# EAGLE design SensorDHT22 (EAGLE 7.5.0)
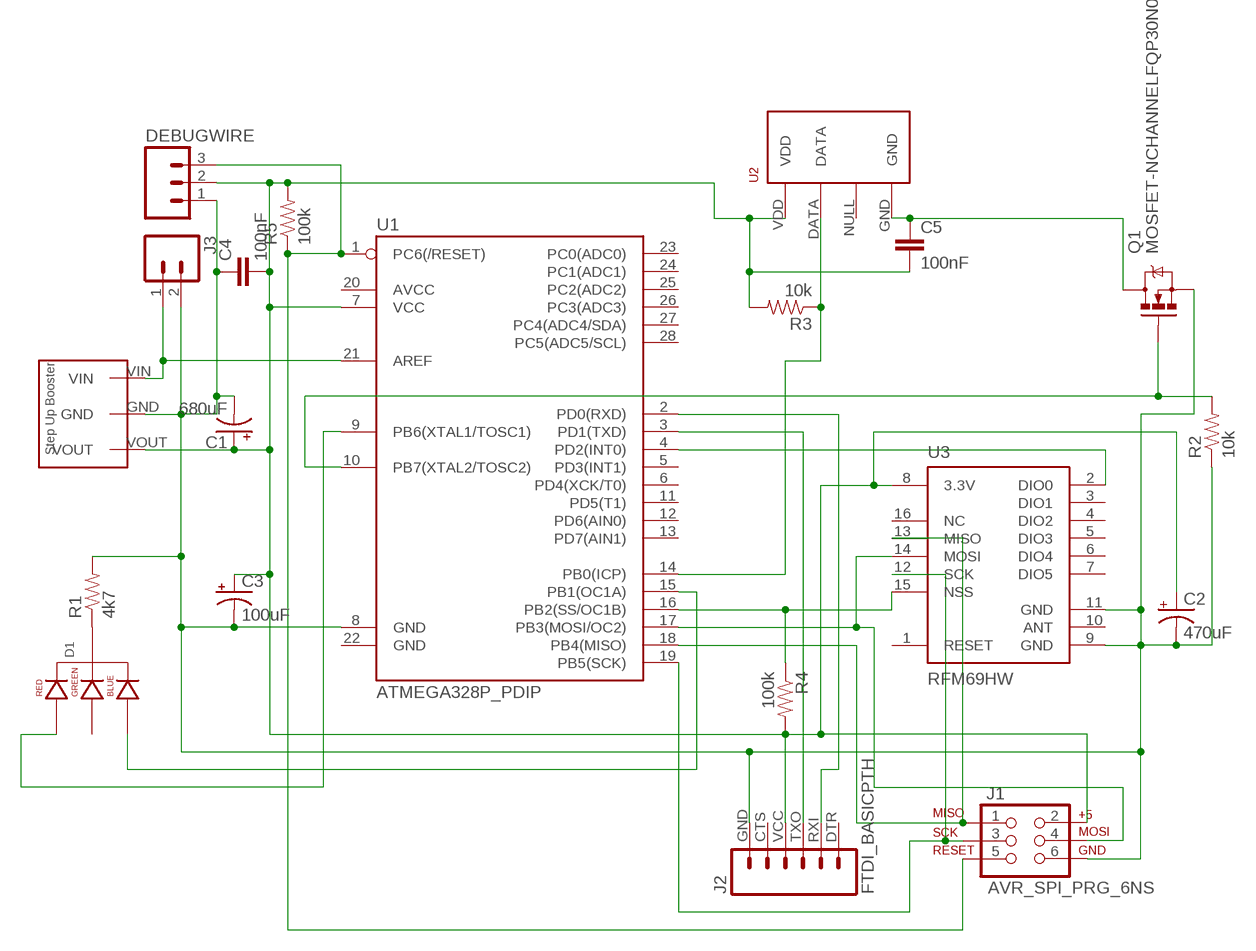
[diagram p0: schematic, sheet 1]

## Parts
C1  680uF  CAP_POLPTH1  [CPOL-RADIAL-100UF-25V]
C2  470uF  CAP_POLPTH1  [CPOL-RADIAL-100UF-25V]
C3  100uF  CAP_POLPTH2  [CPOL-RADIAL-10UF-25V]
C4  100nF  CAPPTH  [CAP-PTH-SMALL]
C5  100nF  CAPPTH  [CAP-PTH-SMALL]
D1  LED-RGB-CC-THRUCLEAR  [LED-RGB-THRU]
DEBUGWIRE  M03PTH  [1X03]
J1  AVR_SPI_PRG_6NS  [2X3-NS]
J2  FTDI_BASICPTH  [FTDI_BASIC]
J3  M02POLAR  [MOLEX-1X2]
Q1  MOSFET-NCHANNELFQP30N06L  [TO220V]
R1  4k7  RESISTORPTH-1/4W  [AXIAL-0.4]
R2  10k  10KOHM-1/4W-1%(PTH)HORIZ  [AXIAL-0.3]
R3  10k  10KOHM-1/4W-1%(PTH)HORIZ  [AXIAL-0.3]
R4  100k  RESISTORPTH-1/4W  [AXIAL-0.4]
R5  100k  100KOHM-1/4W-5%(PTH)  [AXIAL-0.3]
STEPUP  POLOLU-2563  [POLOLU-2563]
U1  ATMEGA328P_PDIP  [DIL28-3]
U2  RHT03_DHT-22_AM2302  [RHT03_DHT-22]
U3  RFM69HW  [RFM69W-XXXS2]

## Nets
N$1: C1.2(-) C2.2(-) C3.2(-) C4.1 DEBUGWIRE.1 J1.6 J2.GND J3.2 Q1.3(S) R1.P$2 R2.P$1 STEPUP.GND U1.8(GND) U3.9(GND) U3.11(GND)
N$2: J3.1 STEPUP.VIN U1.21(AREF)
N$3: C5.1 Q1.2(D) U2.GND
N$4: J2.TXO U1.3(PD1(TXD))
N$5: R4.P$1 U1.16(PB2(SS/OC1B)) U3.15(NSS)
N$6: Q1.1(G) R2.P$2 U1.10(PB7(XTAL2/TOSC2))
N$7: J2.RXI U1.2(PD0(RXD))
N$8: U1.4(PD2(INT0)) U3.2(DIO0)
N$9: R3.P$1 U1.14(PB0(ICP)) U2.DATA
N$10: D1.4(BLUE_CATHODE) U1.15(PB1(OC1A))
N$11: D1.1(RED_CATHODE) U1.9(PB6(XTAL1/TOSC1))
N$12: D1.2(CATHODE) R1.P$1
N$13: J1.4 U1.17(PB3(MOSI/OC2)) U3.14(MOSI)
N$14: J1.1 U1.18(PB4(MISO)) U3.13(MISO)
N$15: DEBUGWIRE.3 J1.5 R5.P$1 U1.1(PC6(/RESET))
N$16: C1.1(+) C2.1(+) C3.1(+) C4.2 C5.2 DEBUGWIRE.2 J1.2 J2.VCC R3.P$2 R4.P$2 R5.P$2 STEPUP.VOUT U1.7(VCC) U2.VDD U3.8(3.3V)
N$17: J1.3 U1.19(PB5(SCK)) U3.12(SCK)
Unconnected: D1.3(GREEN_CATHODE) J2.CTS J2.DTR U1.5(PD3(INT1)) U1.6(PD4(XCK/T0)) U1.11(PD5(T1)) U1.12(PD6(AIN0)) U1.13(PD7(AIN1)) U1.20(AVCC) U1.22(GND) U1.23(PC0(ADC0)) U1.24(PC1(ADC1)) U1.25(PC2(ADC2)) U1.26(PC3(ADC3)) U1.27(PC4(ADC4/SDA)) U1.28(PC5(ADC5/SCL)) U2.NULL U3.1(RESET) U3.3(DIO1) U3.4(DIO2) U3.5(DIO3) U3.6(DIO4) U3.7(DIO5) U3.10(ANT) U3.16(NC)

## Library data of the parts
C1-C3 = SparkFun-Capacitors:CAP_POL: Capacitor Polarized These are standard SMD and PTH capacitors. Normally 10uF, 47uF, and 100uF in electrolytic and tantalum varieties. Always verify the external diameter of the through hole cap, it varies with capacity, voltage, and manufacturer. The EIA devices should be standard.
C4 C5 = SparkFun-Capacitors:CAP: Capacitor Standard 0603 ceramic capacitor, and 0.1" leaded capacitor.
D1 = SparkFun-LED:LED-RGB-CC-THRU: RGB Through-hole common cathode LED SparkFun Storefront: COM-00105 (Clear) COM-09264 (Diffuse); PROD_ID: DIO-08418
DEBUGWIRE = SparkFun-Connectors:M03: Header 3 Standard 3-pin 0.1" header. Use with straight break away headers (SKU : PRT-00116), right angle break away headers (PRT-00553), swiss pins (PRT-00743), machine pins (PRT-00117), and female headers (PRT-00115). Molex polarized connector foot print use with SKU : PRT-08232 with associated crimp pins and housings.
J1 = SparkFun-Connectors:AVR_SPI_PRG_6: AVR ISP 6 Pin This is the reduced ISP connector for AVR programming. Common on Arduino. This footprint will take up less PCB space and can be used with a 10-pin to 6-pin adapter such as SKU: BOB-08508 **Special note about "TEST_POINT" package. The stop mask is on the top side, so if you want your programming test points to be on the bottom of your board, make sure to place this package on the bottom side of the board. This also ensure that the orientation to program from the bottom side will be correct.
J2 = SparkFun-Connectors:FTDI_BASIC: FTDI Basic header with labels
J3 = SparkFun-Connectors:M02: Standard 2-pin 0.1" header. Use with - straight break away headers ( PRT-00116) - right angle break away headers (PRT-00553) - swiss pins (PRT-00743) - machine pins (PRT-00117) - female headers (PRT-00115) Molex polarized connector foot print use with: PRT-08233 with associated crimp pins and housings. 2.54_SCREWTERM for use with PRT-10571. 3.5mm Screw Terminal footprints for PRT-08084 5mm Screw Terminal footprints for use with PRT-08432
Q1 = SparkFun-DiscreteSemi:MOSFET-NCHANNEL: Common NMOSFET Parts MFG P/N Store ID Prod ID FDD8780 TRANS-09984 SI7820DN TRANS-11055 FDS6630A IC-08089 2N7002PW TRANS-11151 FQP30N06L COM-10213 TRANS-10060 BSS123LT1G TRANS-08345 BSS138 TRANS-00830 BS170 2N7000; PROD_ID: TRANS-10060
R1 R4 = SparkFun-Passives:RESISTOR: Resistor Basic schematic elements and footprints for 0603, 1206, and PTH resistors.
R2 R3 = SparkFun-Resistors:10KOHM-1/4W-1%(PTH): RES-12183; PROD_ID: RES-12183
R5 = SparkFun-Resistors:100KOHM-1/4W-5%(PTH): RES-10686; PROD_ID: RES-10686
STEPUP = PololuStepUp:POLOLU-2563
U1 = SparkFun-DigitalIC:ATMEGA328P_PDIP: uC used in the Arduino 32kb flash, 1k EEPROM, 2k SRAM This is the through-hole version of this chip.
U2 = RHT03_DHT-22_AM2302:RHT03_DHT-22_AM2302: RHT03 / DHT-22 / AM2302 Packages and symbol for the RHT03 / DHT-22 relative humidity and temperature sensor. Note: The AM2302 is a wired version of the DHT-22 which typically requires less clearance and is thus provided as a separate package.; PROD_ID: SEN-10167
U3 = SparkFun-RF:RFM69H

## Board
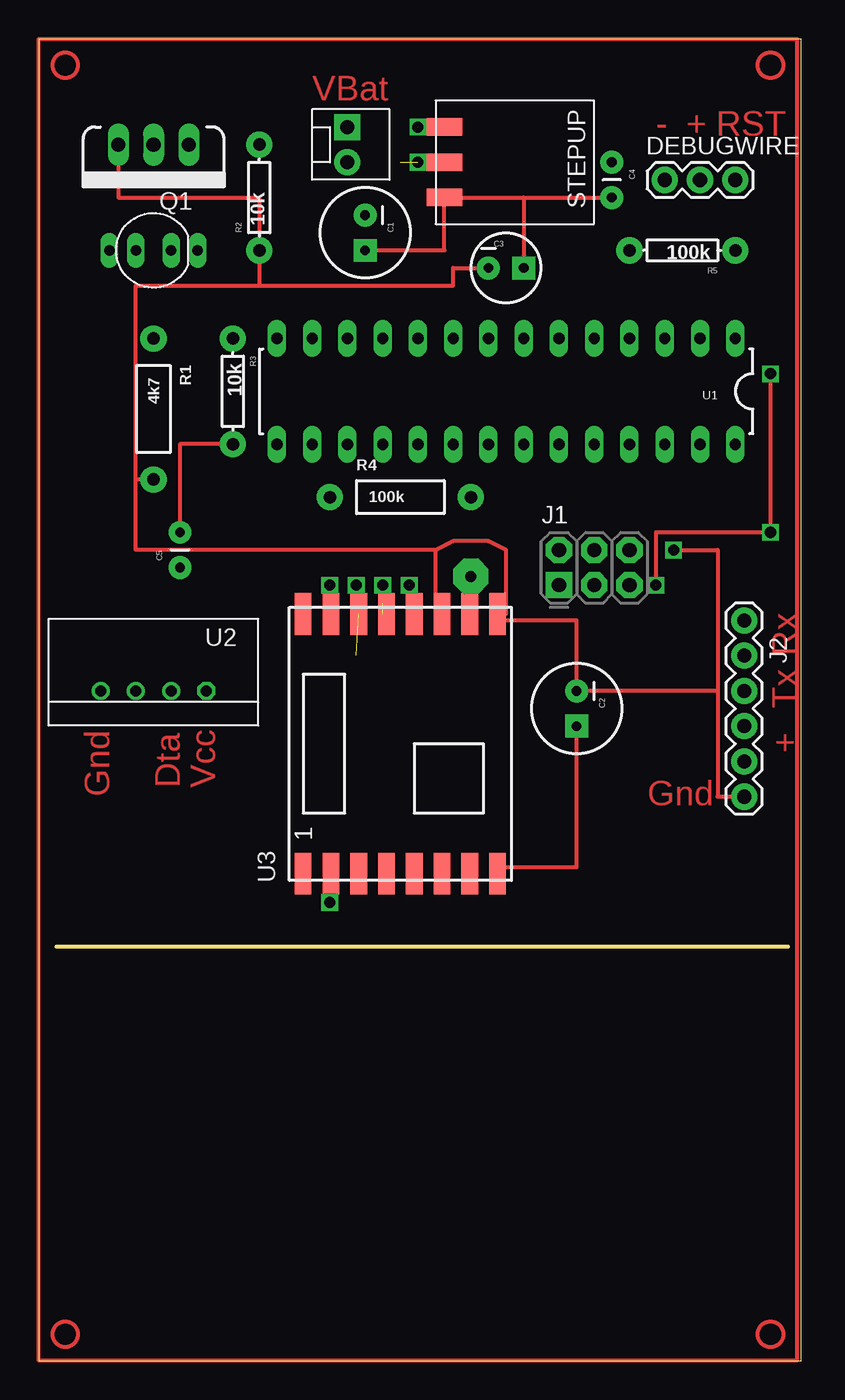
[diagram p1: board, top side]
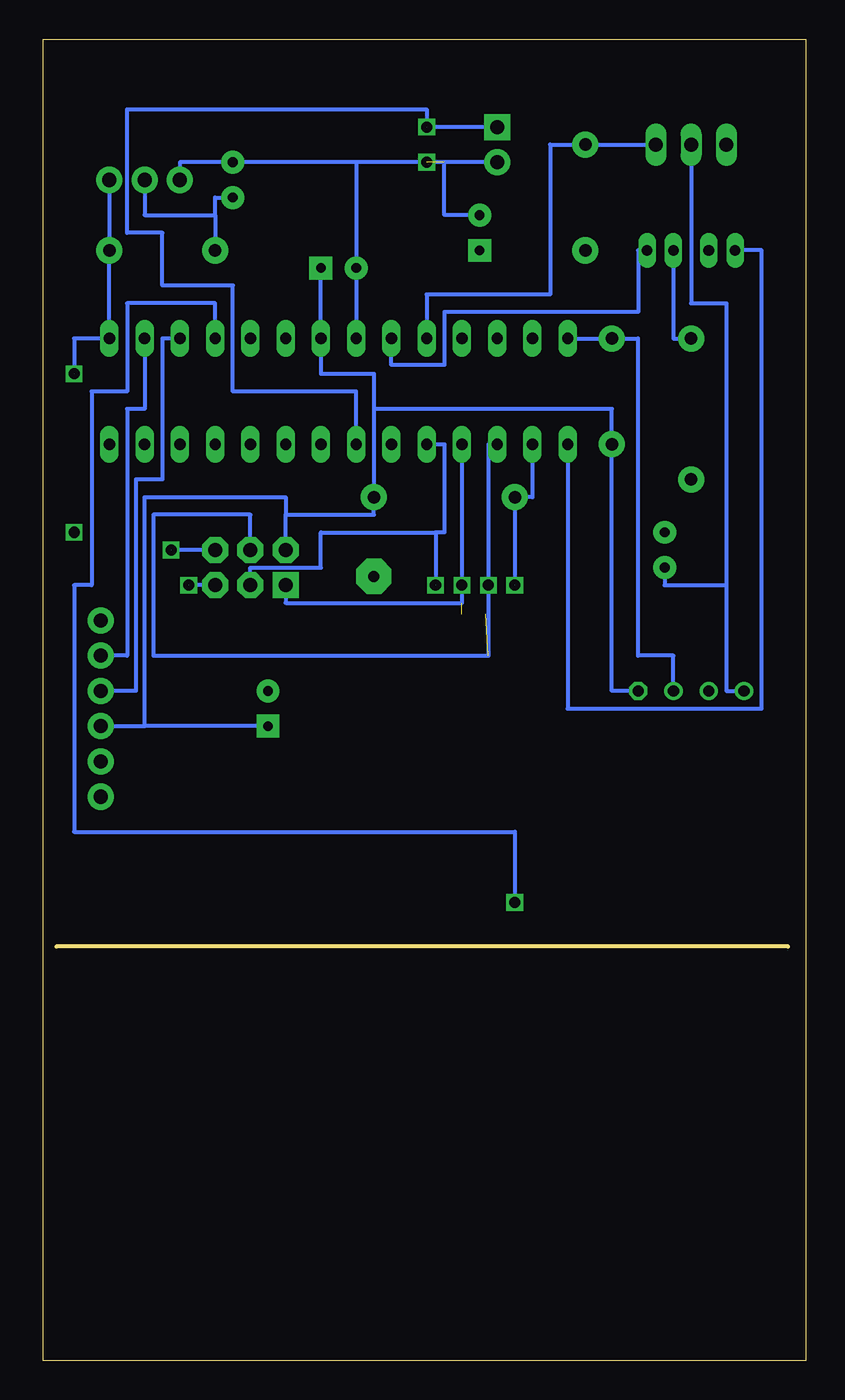
[diagram p2: board, bottom side, seen from below]

Size 54.92 x 95.24 mm. Coordinates in mm from the lower left corner, seen from the top.
Outline: 1.27,29.84 53.97,29.84
Outline: 0,0 54.92,0 54.92,95.24 0,95.24 0,0
Copper layers (1*16): Top 0.035mm / dielectric 1.5mm / Bottom 0.035mm
Design rules "default": minimum track width 10mil, minimum drill 24mil, track to track 8mil, track to pad 8mil, pad to pad 8mil, via to via 8mil, smd to smd 8mil, copper to edge 40mil, drill to drill 8mil, minimum pad ring 10mil, minimum via ring 8mil, stop-mask expansion 4mil, vias tented up to drill 0mil, thermal gap 10mil

### Footprints (pad centres in the part's own frame; a part is rotated, then mirrored left to right if it is on the bottom)
CPOL-RADIAL-100UF-25V = drill 0.7 pad 1.651 square: 1 1.27,0 | drill 0.7 pad 1.651: 2 -1.27,0
CPOL-RADIAL-10UF-25V = drill 0.7 pad 1.651 square: 1 1.27,0 | drill 0.7 pad 1.651: 2 -1.27,0
CAP-PTH-SMALL = drill 0.7 pad 1.651: 1 0,0; 2 2.54,0
LED-RGB-THRU = drill 0.762 pad 0.889 long: 1 3.175,0; 2 1.27,0; 3 -1.27,0; 4 -3.175,0
1X03 = drill 1.016 pad 1.88: 1 0,0; 2 2.54,0; 3 5.08,0
2X3-NS = drill 1.016 pad 1.88 square: 1 -2.54,-1.27 | drill 1.016 pad 1.88 octagon: 2 -2.54,1.27; 3 0,-1.27; 4 0,1.27; 5 2.54,-1.27; 6 2.54,1.27
FTDI_BASIC = drill 1.016 pad 1.88: CTS 10.16,0; DTR 0,0; GND 12.7,0; RXI 2.54,0; TXO 5.08,0; VCC 7.62,0
MOLEX-1X2 = drill 1.016 pad 1.88 square: 1 0,0 | drill 1.016 pad 1.88: 2 2.54,0
TO220V = drill 1.016 long: 1 -2.54,0; 2 0,0; 3 2.54,0
AXIAL-0.4 = drill 0.9 pad 1.88: P$1 -5.08,0; P$2 5.08,0
AXIAL-0.3 = drill 0.9 pad 1.88: P$1 -3.81,0; P$2 3.81,0
POLOLU-2563 = smd 1.27 x 2.54: GND 0,-0.635; VIN -2.54,-0.635; VOUT 2.54,-0.635
DIL28-3 = drill 0.813 long: 1 -16.51,-3.81; 2 -13.97,-3.81; 3 -11.43,-3.81; 4 -8.89,-3.81; 5 -6.35,-3.81; 6 -3.81,-3.81; 7 -1.27,-3.81; 8 1.27,-3.81; 9 3.81,-3.81; 10 6.35,-3.81; 11 8.89,-3.81; 12 11.43,-3.81; 13 13.97,-3.81; 14 16.51,-3.81; 15 16.51,3.81; 16 13.97,3.81; 17 11.43,3.81; 18 8.89,3.81; 19 6.35,3.81; 20 3.81,3.81; 21 1.27,3.81; 22 -1.27,3.81; 23 -3.81,3.81; 24 -6.35,3.81; 25 -8.89,3.81; 26 -11.43,3.81; 27 -13.97,3.81; 28 -16.51,3.81
RHT03_DHT-22 = drill 0.8: DATA -1.27,0; GND 3.81,0; NULL 1.27,0 | drill 0.8 octagon: VDD -3.81,0
RFM69W-XXXS2 = smd 3 x 1.2: 1 -9.35,7; 2 -9.35,5; 3 -9.35,3; 4 -9.35,1; 5 -9.35,-1; 6 -9.35,-3; 7 -9.35,-5; 8 -9.35,-7; 9 9.35,-7; 10 9.35,-5; 11 9.35,-3; 12 9.35,-1; 13 9.35,1; 14 9.35,3; 15 9.35,5; 16 9.35,7

### Placement (x,y rotation side)
C1  23.5,81.28 270 top
C2  38.73,46.99 270 top
C3  33.66,78.74 0 top
C4  41.28,86.36 270 top
C5  10.16,57.15 90 top
D1  8.26,80.01 0 top
DEBUGWIRE  45.08,85.09 0 top
J1  40,57.15 0 top
J2  50.8,53.34 270 top
J3  22.23,88.9 270 top
Q1  8.26,87.63 180 top
R1  8.26,68.58 270 top
R2  15.88,83.82 90 top
R3  13.97,69.85 270 top
R4  26.04,62.23 0 top
R5  46.36,80.01 180 top
STEPUP  29.85,86.36 270 top
U1  33.66,69.85 180 top
U2  8.26,48.26 180 top
U3  26.04,44.45 90 top

### Tracks (layer width: path | path; a pad name or v marks a point on that pad's centre or on a via)
N$1  (2 unrouted)
  Top 0.305: U3.9 33.02,53.82 33.66,53.82 33.66,58.42 32.39,59.05 29.85,59.05 28.57,58.42 | 28.57,58.42 6.98,58.42 6.98,63.5 | 6.98,63.5 6.98,77.47 15.88,77.47 | 15.88,77.47 29.85,77.47 29.85,78.74 C3.2 | 33.5,53.34 38.73,53.34 C2.2 48.89,48.26 | 45.72,58.42 48.89,58.42 48.89,48.26 | STEPUP.GND 27.31,86.36 | U3.11 28.57,53.8 28.57,58.42 | 48.89,48.26 48.89,40.64 J2.GND | R1.P$2 6.98,63.5 | Q1.3 5.71,83.82 15.88,83.82 R2.P$1 15.88,77.47
  Top 0.406: U3.9 33.5,53.34
  Bottom 0.305: J3.2 26.04,86.36 | 26.04,86.36 32.39,86.36 | U1.8 C3.2 32.39,86.36 | 32.39,86.36 C4.1 45.08,86.36 DEBUGWIRE.1 | J1.6 45.72,58.42 | C1.2 26.04,82.55 26.04,86.36
N$2  (1 unrouted)
  Top 0.305: STEPUP.VIN 27.31,88.9
  Bottom 0.305: J3.1 27.31,88.9 27.31,90.17 48.89,90.17 48.89,81.28 46.36,81.28 46.36,77.47 41.28,77.47 41.28,69.85 32.39,69.85 U1.21
N$3
  Bottom 0.305: 5.71,55.88 5.71,48.26 U2.GND | C5.1 10.16,55.88 5.71,55.88 | Q1.2 8.26,76.2 5.71,76.2 5.71,55.88
N$4
  Bottom 0.305: U1.3 46.36,73.66 46.36,63.5 48.26,63.5 48.26,48.26 J2.TXO
N$5  (1 unrouted)
  Top 0.305: U3.15 20.96,53.8 20.96,55.88
  Bottom 0.305: 20.96,55.88 R4.P$1 19.68,62.23 U1.16
N$6
  Bottom 0.305: U1.10 27.31,76.83 18.41,76.83 18.41,87.63 R2.P$2 Q1.1
N$7
  Bottom 0.305: U1.2 47.62,68.58 48.89,68.58 48.89,50.8 J2.RXI
N$8  (via drill 0.8)
  Top 0.305: v20.96,33.02 21.04,33.02 U3.2
  Bottom 0.305: U1.4 42.55,76.2 48.89,76.2 48.89,69.85 51.44,69.85 51.44,55.88 52.7,55.88 52.7,38.1 20.96,38.1 v20.96,33.02
N$9
  Bottom 0.305: U2.DATA 9.53,50.8 12.07,50.8 12.07,73.66 R3.P$1 U1.14
N$10
  Bottom 0.305: U1.15 17.14,46.99 3.18,46.99 3.18,80.01 D1.4
N$11
  Bottom 0.305: D1.1 12.07,80.01 12.07,75.56 26.04,75.56 26.04,71.75 29.85,71.75 U1.9
N$12
  Bottom 0.305: D1.2 9.53,73.66 R1.P$1
N$13  (1 unrouted)
  Top 0.305: U3.14 22.86,53.8 22.86,55.88
  Bottom 0.305: U1.17 22.86,66.04 22.86,50.8 46.99,50.8 46.99,60.96 40,60.96 J1.4
N$14  (1 unrouted)
  Top 0.305: U3.13 24.77,53.8 24.77,55.88
  Bottom 0.305: U1.18 24.77,54.61 37.47,54.61 J1.1
N$15  (via drill 0.8)  (2 unrouted)
  Top 0.305: 52.7,71.12 v52.7,59.69 44.45,59.69 44.45,55.88
  Bottom 0.305: 52.7,71.12 52.7,73.66 U1.1 R5.P$1 DEBUGWIRE.3 | J1.5 44.45,55.88
N$16
  Top 0.305: 34.92,83.82 STEPUP.VOUT 29.21,80.01 C1.1 | 34.92,83.82 C3.1 | 33.5,35.56 38.73,35.56 C2.1 | 34.92,83.82 C4.2 | R3.P$2 10.16,66.04 C5.2
  Top 0.406: U3.8 33.5,35.56
  Bottom 0.305: C3.1 U1.7 34.92,71.12 31.11,71.12 31.11,68.58 | 31.11,68.58 R4.P$2 31.11,60.96 37.47,60.96 | J1.2 37.47,60.96 | C2.1 47.62,45.72 | 47.62,45.72 47.62,62.23 37.47,62.23 37.47,60.96 | J2.VCC 47.62,45.72 | DEBUGWIRE.2 47.62,82.55 42.55,82.55 | 42.55,82.55 R5.P$2 | 42.55,82.55 42.55,83.82 C4.2 | 31.11,68.58 13.97,68.58 R3.P$2 13.97,48.26 U2.VDD
N$17  (1 unrouted)
  Top 0.305: U3.12 26.67,53.8 26.67,55.88
  Bottom 0.305: U1.19 26.04,66.04 26.04,59.69 26.67,59.69 | 26.67,59.69 26.67,55.88 | J1.3 40,57.15 34.92,57.15 34.92,59.69 26.67,59.69
N$18  (via drill 0.8)
  other vias: 27.31,88.9
N$19  (via drill 0.8)
  other vias: 27.31,86.36
N$20  (via drill 0.8)
  other vias: 45.72,58.42
N$21  (via drill 0.8)
  other vias: 20.96,55.88
N$22  (via drill 0.8)
  other vias: 22.86,55.88
N$23  (via drill 0.8)
  other vias: 24.77,55.88
N$24  (via drill 0.8 pad 2.54)
  other vias: 31.11,56.52
N$25  (via drill 0.8)
  other vias: 44.45,55.88
N$26  (via drill 0.8)
  other vias: 52.7,71.12
N$27  (via drill 0.8)
  other vias: 26.67,55.88
N$28
  Top 0.305: 0,95.25 54.61,95.25 54.61,0 0,0 0,95.25
(copper drawn outside any net)
  shapes: Top circle x4

### Text on the board
Top: VBat | - + RST | Rx | Tx | + | Dta | Vcc | Gnd | Gnd